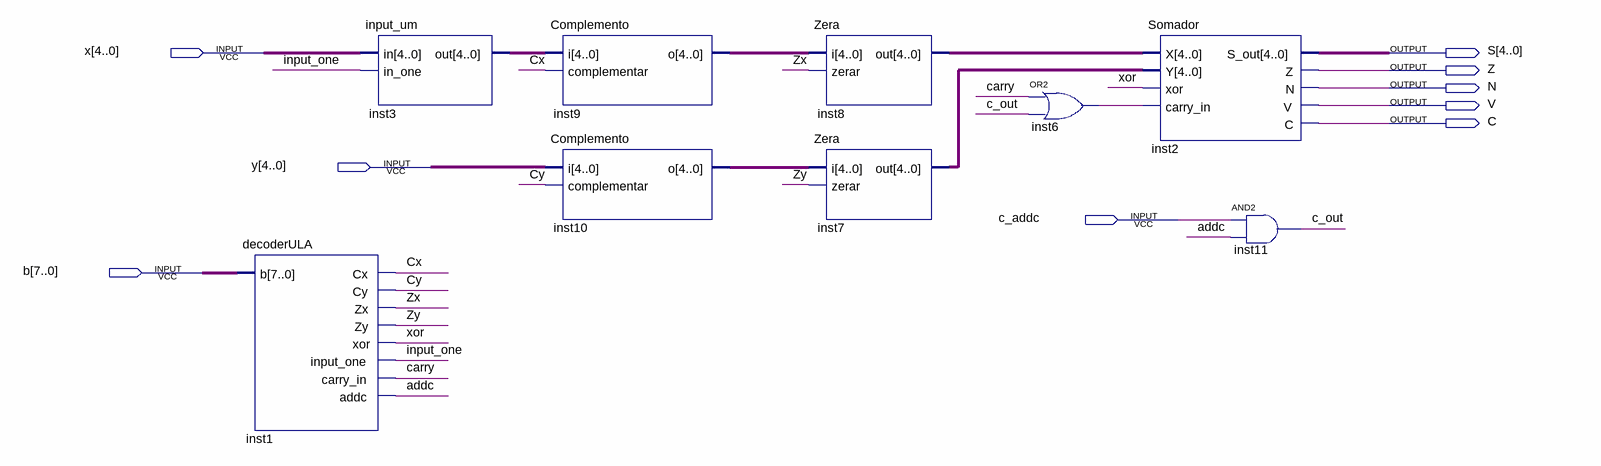
[diagram p0: schematic sheet]
// Quartus schematic ULA.bdf as structural Verilog: 9 symbols, 9 pins
module ULA (
  input  [4:0] x,
  input  [4:0] y,
  input  c_addc,
  input  [7:0] b,
  output [4:0] S,
  output Z,
  output N,
  output V,
  output C
);

  wire addc, c_out, carry, Cx, Cy, input_one, inst6_out, \xor , Zx, Zy;
  wire [4:0] inst3_out, inst7_out, inst8_out, inst9_o, inst10_o;

  decoderULA inst1 (
    .b(b), .Cx(Cx), .Cy(Cy), .Zx(Zx), .Zy(Zy), .\xor (\xor ), .input_one(input_one), .carry_in(carry),
    .addc(addc));
  input_um inst3 (.in(x), .in_one(input_one), .out(inst3_out));
  Complemento inst9 (.i(inst3_out), .complementar(Cx), .o(inst9_o));
  Complemento inst10 (.i(y), .complementar(Cy), .o(inst10_o));
  Zera inst8 (.i(inst9_o), .zerar(Zx), .out(inst8_out));
  Zera inst7 (.i(inst10_o), .zerar(Zy), .out(inst7_out));
  or inst6 (inst6_out, carry, c_out);
  Somador inst2 (
    .X(inst8_out), .Y(inst7_out), .\xor (\xor ), .carry_in(inst6_out), .S_out(S), .Z(Z), .N(N), .V(V), .C(C));
  and inst11 (c_out, c_addc, addc);
endmodule
